# Altium schematic sheet Industrial-Controller_ESP8266.SchDoc: ESP8266
size 279 x 215 mm; Date: not used; ApprovedBy: not used; CheckedBy: not used; Author: not used; DrawnBy: not used; Organization: not used; Address4: not used; SheetNumber: 8; SheetTotal: 21; Time: not used; ImagePath: not used; Application_BuildNumber: not used
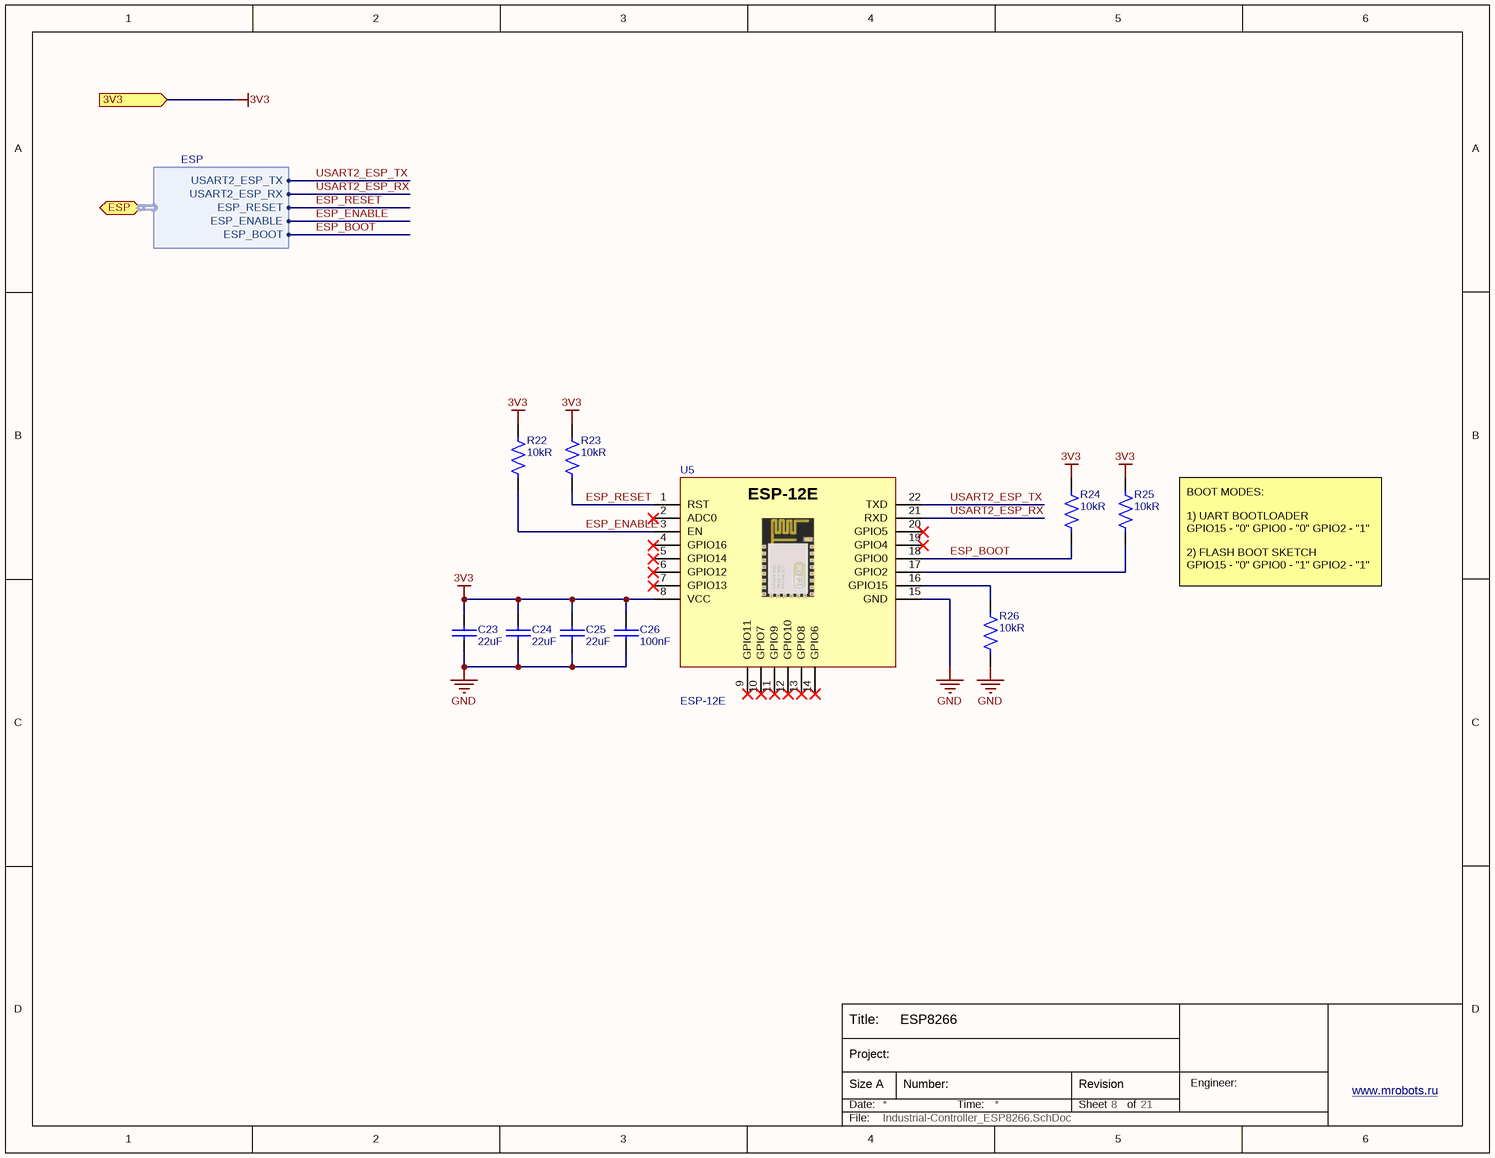
[diagram p0: Industrial-Controller_ESP8266.SchDoc]

## Parts
C23  22uF  [CAP_1210]
C24  22uF  [CAP_1210]
C25  22uF  [CAP_1210]
C26  100nF  [CAP_0603]
R22  10kR  [RES_0603]
R23  10kR  [RES_0603]
R24  10kR  [RES_0603]
R25  10kR  [RES_0603]
R26  10kR  [RES_0603]
U5  ESP-12E  [ESP-12E]

## Ports
3V3 (in), ESP (bidir, harness ESP)

## Harnesses
ESP: USART2_ESP_TX, USART2_ESP_RX, ESP_RESET, ESP_ENABLE, ESP_BOOT

## Nets
3V3: C23.2 C24.2 C25.2 C26.1 R22.1 R23.1 R24.1 R25.1 U5.8(VCC) ; port 3V3
GND: C23.1 C24.1 C25.1 C26.2 R26.2 U5.15(GND)
ESP_BOOT: R24.2 U5.18(GPIO0) ; port ESP.ESP_BOOT
ESP_ENABLE: R22.2 U5.3(EN) ; port ESP.ESP_ENABLE
ESP_RESET: R23.2 U5.1(RST) ; port ESP.ESP_RESET
USART2_ESP_RX: U5.21(RXD) ; port ESP.USART2_ESP_RX
USART2_ESP_TX: U5.22(TXD) ; port ESP.USART2_ESP_TX
NetR25_2: R25.2 U5.17(GPIO2)
NetR26_1: R26.1 U5.16(GPIO15)

Not connected (* = marked no-connect by the designer): U5 2(ADC0)* 4(GPIO16)* 5(GPIO14)* 6(GPIO12)* 7(GPIO13)* 9(GPIO11)* 10(GPIO7)* 11(GPIO9)* 12(GPIO10)* 13(GPIO8)* 14(GPIO6)* 19(GPIO4)* 20(GPIO5)*

## Notes on the sheet
- BOOT MODES:
  1) UART BOOTLOADER
  GPIO15 - "0" GPIO0 - "0" GPIO2 - "1"
  2) FLASH BOOT SKETCH
  GPIO15 - "0" GPIO0 - "1" GPIO2 - "1"
- Title:
- Date:
- Size A
- Project:
- Number:
- Time:
- Sheet
- Revision
- of
- Engineer:
- www.mrobots.ru <http://mrobots.ru/>
- File:

## Library data of the parts
C23-C25 = CL32B226KAJNNNE: CAP CER 22UF 25V X7R 1210; Manufacturer 1: Samsung; Material: Ceramic; Tolerance: 10%; Supplier 1: Digi-Key; Manufacturer Part Number 1: CL32B226KAJNNNE; RoHS: Yes; Category: Ceramic Capacitors; Stock 1: 784003; Pricing 1: 1=0,58000, 10=0,41000, 50=0,31000, 100=0,26990, 500=0,19996 (USD); Mount: Surface Mount; Case/Package: 1210; Case Code (Metric): 3225; Case Code (Imperial): 1210; Min Operating Temperature: -55°C; Max Operating Temperature: 125°C; Package Quantity: 1; Packaging: Tape and Reel; Capacitance: 22uF; Voltage Rating: 25V; Dielectric: X7R; Series: CL; Construction: Flat; Voltage Rating (DC): 25V; Length: 3.2mm; Width: 0.098inch; Height: 2.5mm; Thickness: 0.106inch; Depth: 2.5mm; Radiation Hardening: No; RoHS Compliant: Yes; Lead Free: Lead Free; ComponentLink1URL: https://datasheet.ciiva.com/25714/cl32b226kajnnne-25714610.pdf?src-supplier=Digi-Key; ComponentLink1Description: https://datasheet.ciiva.com/25714/cl32b226kajnnne-25714610.pdf?src-supplier=Digi-Key; Supplier Part Number 1: 1276-3392-1-ND
C26 = CL10B104KB8NNNL: CAP CER 0.1UF 50V X7R 0603; Manufacturer 1: Samsung; Tolerance: 10%; Supplier 1: Digi-Key; Manufacturer Part Number 1: CL10B104KB8NNNL; RoHS: Yes; Category: Ceramic Capacitors; Stock 1: 2348404; Pricing 1: 15000=0,00532, 30000=0,00506 (USD); Mount: Surface Mount; Case/Package: 0603; Min Operating Temperature: -55°C; Max Operating Temperature: 125°C; Capacitance: 100nF; Packaging: Tape and Reel; Package Quantity: 15000; Voltage Rating: 50V; Dielectric: X7R; Voltage Rating (DC): 50V; Series: CL; Construction: Flat; Length: 1.6mm; Width: 0.031inch; Height: 0.8mm; Thickness: 0.035inch; Depth: 0.8mm; Radiation Hardening: No; RoHS Compliant: Yes; ComponentLink1URL: https://datasheet.ciiva.com/26838/getdatasheetpartid-357523-26838415.pdf?src-supplier=Verical; ComponentLink1Description: https://datasheet.ciiva.com/26838/getdatasheetpartid-357523-26838415.pdf?src-supplier=Verical; ComponentLink2URL: https://datasheet.ciiva.com/25741/cl10b104kb8nnnl-25741341.pdf?src-supplier=Digi-Key; ComponentLink2Description: https://datasheet.ciiva.com/25741/cl10b104kb8nnnl-25741341.pdf?src-supplier=Digi-Key; Supplier Part Number 1: 1276-CL10B104KB8NNNLTR-ND
R22-R26 = RC0603FR-0710KL: RES 10K OHM 1% 1/10W 0603; Manufacturer 1: Yageo; Voltage Rating (DC): 50V; Temperature Coefficient: 100ppm/°C; Power Rating: 100mW; Voltage Rating: 75V; Supplier 1: Arrow Electronics; RoHS: Yes; Category: Chip SMD Resistors; Stock 1: 4950000; Pricing 1: 5000=0,00240 (USD); Case/Package: 0603; Number of Pins: 2; Case Code (Imperial): 0603; Case Code (Metric): 1608; Weight: 7.1E-05oz; Size Code: 0603; Min Operating Temperature: -55°C; Max Operating Temperature: 155°C; Packaging: Tape and Reel; Resistance: 10kR; Tolerance: 1%; Resistor Type: Thick Film; Termination: SMD/SMT; Features: Moisture Resistant; Series: RC; Max Power Dissipation: 100mW; Number of Terminations: 2; Resistance Tolerance: 1%; Construction: Rectangular; Length: 1.6mm; Width: 0.8mm; Height: 0.45mm; Depth: 0.8mm; Lead Pitch: 0.3mm; REACH SVHC: Unknown; Lead Free: Lead Free; Military Standard: Not; RoHS Compliant: Yes; ComponentLink1URL: https://datasheet.ciiva.com/7660/38590-7660789.pdf?src-supplier=Element14; ComponentLink1Description: https://datasheet.ciiva.com/7660/38590-7660789.pdf?src-supplier=Element14; ComponentLink2URL: https://datasheet.ciiva.com/7983/443971-7983596.pdf?src-supplier=Element14; ComponentLink2Description: https://datasheet.ciiva.com/7983/443971-7983596.pdf?src-supplier=Element14; ComponentLink3URL: https://datasheet.ciiva.com/22747/443971-22747519.pdf?src-supplier=Element14; ComponentLink3Description: https://datasheet.ciiva.com/22747/443971-22747519.pdf?src-supplier=Element14; ComponentLink4URL: https://datasheet.ciiva.com/46440/1868787-46440891.pdf?src-supplier=Element14; ComponentLink4Description: https://datasheet.ciiva.com/46440/1868787-46440891.pdf?src-supplier=Element14; ComponentLink5URL: https://datasheet.ciiva.com/7746/1738695-7746239.pdf?src-supplier=Element14; ComponentLink5Description: https://datasheet.ciiva.com/7746/1738695-7746239.pdf?src-supplier=Element14; Supplier Part Number 1: RC0603FR-0710KL; Manufacturer Part Number 1: RC0603FR-0710KL
U5 = ESP-12E: MOD 802.11 BLUETOOTH 5 CHIP ANT; Manufacturer 1: Ai-Thinker; Manufacturer Part Number 1: ESP-12E